# Altium schematic sheet Nixie_3.SchDoc
size A4; SheetNumber: 6; SheetTotal: 7
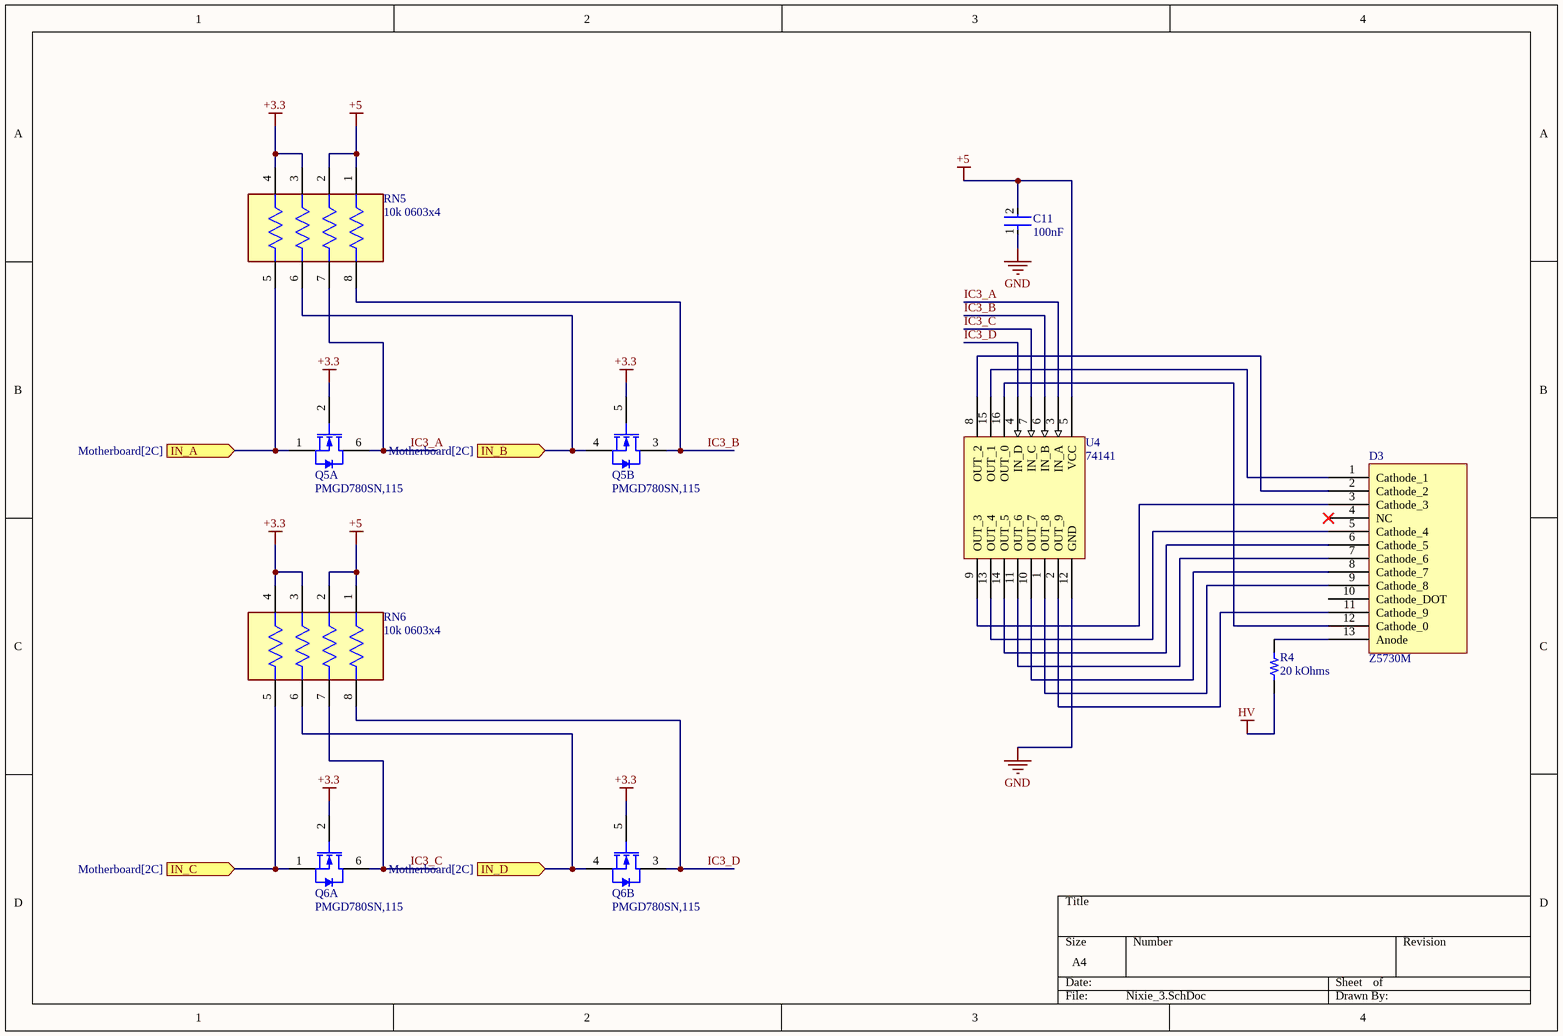
[diagram p0: Nixie_3.SchDoc]

## Parts
C11  100nF  [FP-C1005-050-0_15-MFG]
D3  Z5730M  [Z5730M]
Q5  PMGD780SN,115  [NXP-SOT363_N]  (parts A,B of 2)
Q6  PMGD780SN,115  [NXP-SOT363_N]  (parts A,B of 2)
R4  20 kOhms  [RES 1210_3225]
RN5  10k 0603x4  [FP-EXB38V-MFG]
RN6  10k 0603x4  [FP-EXB38V-MFG]
U4  74141  [DIP-16]

## Ports
IN_A (in, see Motherboard[2C]), IN_B (in, see Motherboard[2C]), IN_C (in, see Motherboard[2C]), IN_D (in, see Motherboard[2C])

## Nets
+3.3: Q5.2(G1) Q5.5(G2) Q6.2(G1) Q6.5(G2) RN5.3 RN5.4 RN6.3 RN6.4
+5: C11.2 RN5.1 RN5.2 RN6.1 RN6.2 U4.5(VCC)
GND: C11.1 U4.12(GND)
HV: R4.1
IC3_A: Q5.6(D1) RN5.7 U4.3(IN_A)
IC3_B: Q5.3(D2) RN5.8 U4.6(IN_B)
IC3_C: Q6.6(D1) RN6.7 U4.7(IN_C)
IC3_D: Q6.3(D2) RN6.8 U4.4(IN_D)
IN_A: Q5.1(S1) RN5.5 ; port IN_A
IN_B: Q5.4(S2) RN5.6 ; port IN_B
IN_C: Q6.1(S1) RN6.5 ; port IN_C
IN_D: Q6.4(S2) RN6.6 ; port IN_D
NetD3_1: D3.1(Cathode_1) U4.15(OUT_1)
NetD3_2: D3.2(Cathode_2) U4.8(OUT_2)
NetD3_3: D3.3(Cathode_3) U4.9(OUT_3)
NetD3_5: D3.5(Cathode_4) U4.13(OUT_4)
NetD3_6: D3.6(Cathode_5) U4.14(OUT_5)
NetD3_7: D3.7(Cathode_6) U4.11(OUT_6)
NetD3_8: D3.8(Cathode_7) U4.10(OUT_7)
NetD3_9: D3.9(Cathode_8) U4.1(OUT_8)
NetD3_11: D3.11(Cathode_9) U4.2(OUT_9)
NetD3_12: D3.12(Cathode_0) U4.16(OUT_0)
NetD3_13: D3.13(Anode) R4.2

Not connected (* = marked no-connect by the designer): D3 4(NC)* 10(Cathode_DOT)

## Library data of the parts
C11 = CMP-2000-05438-2: CAP CER 100nF 10V X5R 0402; Dielectric Material: Ceramic; Tolerance: 20%; Capacitance: 4.7uF; RoHS Compliant: Yes; Lead Free: Lead Free; Max Operating Temperature: 85°C; Case Code (Metric): 1005; Dielectric: X5R; Height: 0.5mm; Length: 1mm; Case Code (Imperial): 0402; Width: 0.02inch; Mount: Surface Mount; Case/Package: 0402; Min Operating Temperature: -55°C; Radiation Hardening: No; Resistor Type: Ceramic; Construction: Flat; REACH SVHC: No SVHC; Voltage Rating (DC): 10V; Voltage Rating: 10V; Package Quantity: 1; Termination: SMD/SMT; Thickness: 500um; Voltage: 10V; Packaging: Tape and Reel; Depth: 0.5mm; Weight: 2.3E-05oz; Series: C
Q5 Q6 = CMP-1258-00177-1: Dual N-Channel uTrenchMOS Standard Level FET, 60 V, 0.49 A, 6-Pin SOT363, Tape and Reel; Manufacturer: NXP Semiconductors; ID [max] (A): 0.49; Packing: Tape & Reel; Channel Type: N; Coss [typ] (pF): 5; VDS [max] (V): 60; VGSth [typ] (V): 2; Ciss [typ] (pF): 23; ComponentLink1Description: Manufacturer URL; ComponentLink2Description: Datasheet; ComponentLink2URL: http://www.nxp.com/documents/data_sheet/PMGD780SN.pdf; PackageReference: SOT363; PartNumber: PMGD780SN,115; Mounting Technology: Surface Mount; DatasheetVersion: Rev. 02; PackageDescription: 6-Pin Small Outline Transistor Package, Body 2 x 1.25 mm, Pitch 0.65 mm; ComponentLink3Description: Package Specification; Code_JEITA: SC-88; ComponentLink1URL: http://www.nxp.com/; ComponentLink3URL: http://www.nxp.com/documents/outline_drawing/sot363_po.pdf; PackageVersion: 06-03-16, 03/2006
R4 = CRCW121020K0FKEAHP: RES SMD 20K OHM 1% 3/4W 1210; Manufacturer: Vishay Dale; Power (Watts): 0.75W, 3/4W; Temperature Coefficient: ±100ppm/°C; Part Number: CRCW121020K0FKEAHP; ComponentLink1Description: Datasheet; ComponentLink1URL: http://www.vishay.com/docs/20043/crcwhpe3.pdf; ComponentLink2Description: DigiKey Link; ComponentLink2URL: http://digikey.com/product-detail/en/vishay-dale/CRCW121020K0FKEAHP/541-20.0KDCT-ND/2567330; Composition: Thick Film; Device Package: 1210 (3225 Metric); Features: Automotive AEC-Q200, Pulse Withstanding; Height - Seated (Max): 0.028" (0.70mm); LastUpdated: 27.03.2023 20:03:38; Lifecycle Status: Active; Minimum Order: 1; Number of Terminations: 2; Operating Temperature: -55°C ~ 155°C; Package / Case: 1210 (3225 Metric); Packaging: TapeAndReel; Part Status: Active; Price: 0.07; Ratings: AEC-Q200; Resistance: 20 kOhms; Series: CRCW-HP; Size / Dimension: 0.126" L x 0.098" W (3.20mm x 2.50mm); Supplier 1: DigiKey; Supplier Part Number 1: 541-20.0KDCT-ND; Supplier Device Package: 1210; Tolerance: ±1%; Value: 20 kOhms
RN5 RN6 = CMP-2000-05314-2: RES ARRAY 4 RES 10K OHM 1206 / RC-ML08W103JT; Number of Terminals/Pins: 8; Number of Elements: 4; Tolerance: 5%; Resistance: 10kR; Temperature Coefficient: 200ppm/°C; Power Per Element: 62.5mW; Voltage Rating (DC): 100V; Circuit Type: Isolated; Power Dissipation: 63mW; Voltage Rating: 50V; Max Operating Temperature: 125°C; Terminal Pitch: 0.8mm; Mount: Surface Mount; Width: 1.6mm; Military Standard: Not; Length: 3.2mm; Lead Free: Lead Free; Case Code (Imperial): 1206; Packaging: Tape and Reel; Height: 0.5mm; Package Quantity: 1; Number of Resistors: 4; Depth: 1.6mm; Number of Contacts: 8; Number of Pins: 8; Series: EXB; Min Operating Temperature: -55°C; Case Code (Metric): 3216; Case/Package: 1206; Radiation Hardening: No; Termination: Convex; Resistance Tolerance: 5%; RoHS Compliant: Yes; Size Code: 0603; Contact Plating: Tin; Technology: THICK FILM